# Altium schematic sheet Digital_Input.SchDoc: TTL Input Card
size Tabloid; Date: 05/10/2023; Engineer: Terry D. Schevker; Revision: 1.0; SheetNumber: 1; SheetTotal: 3
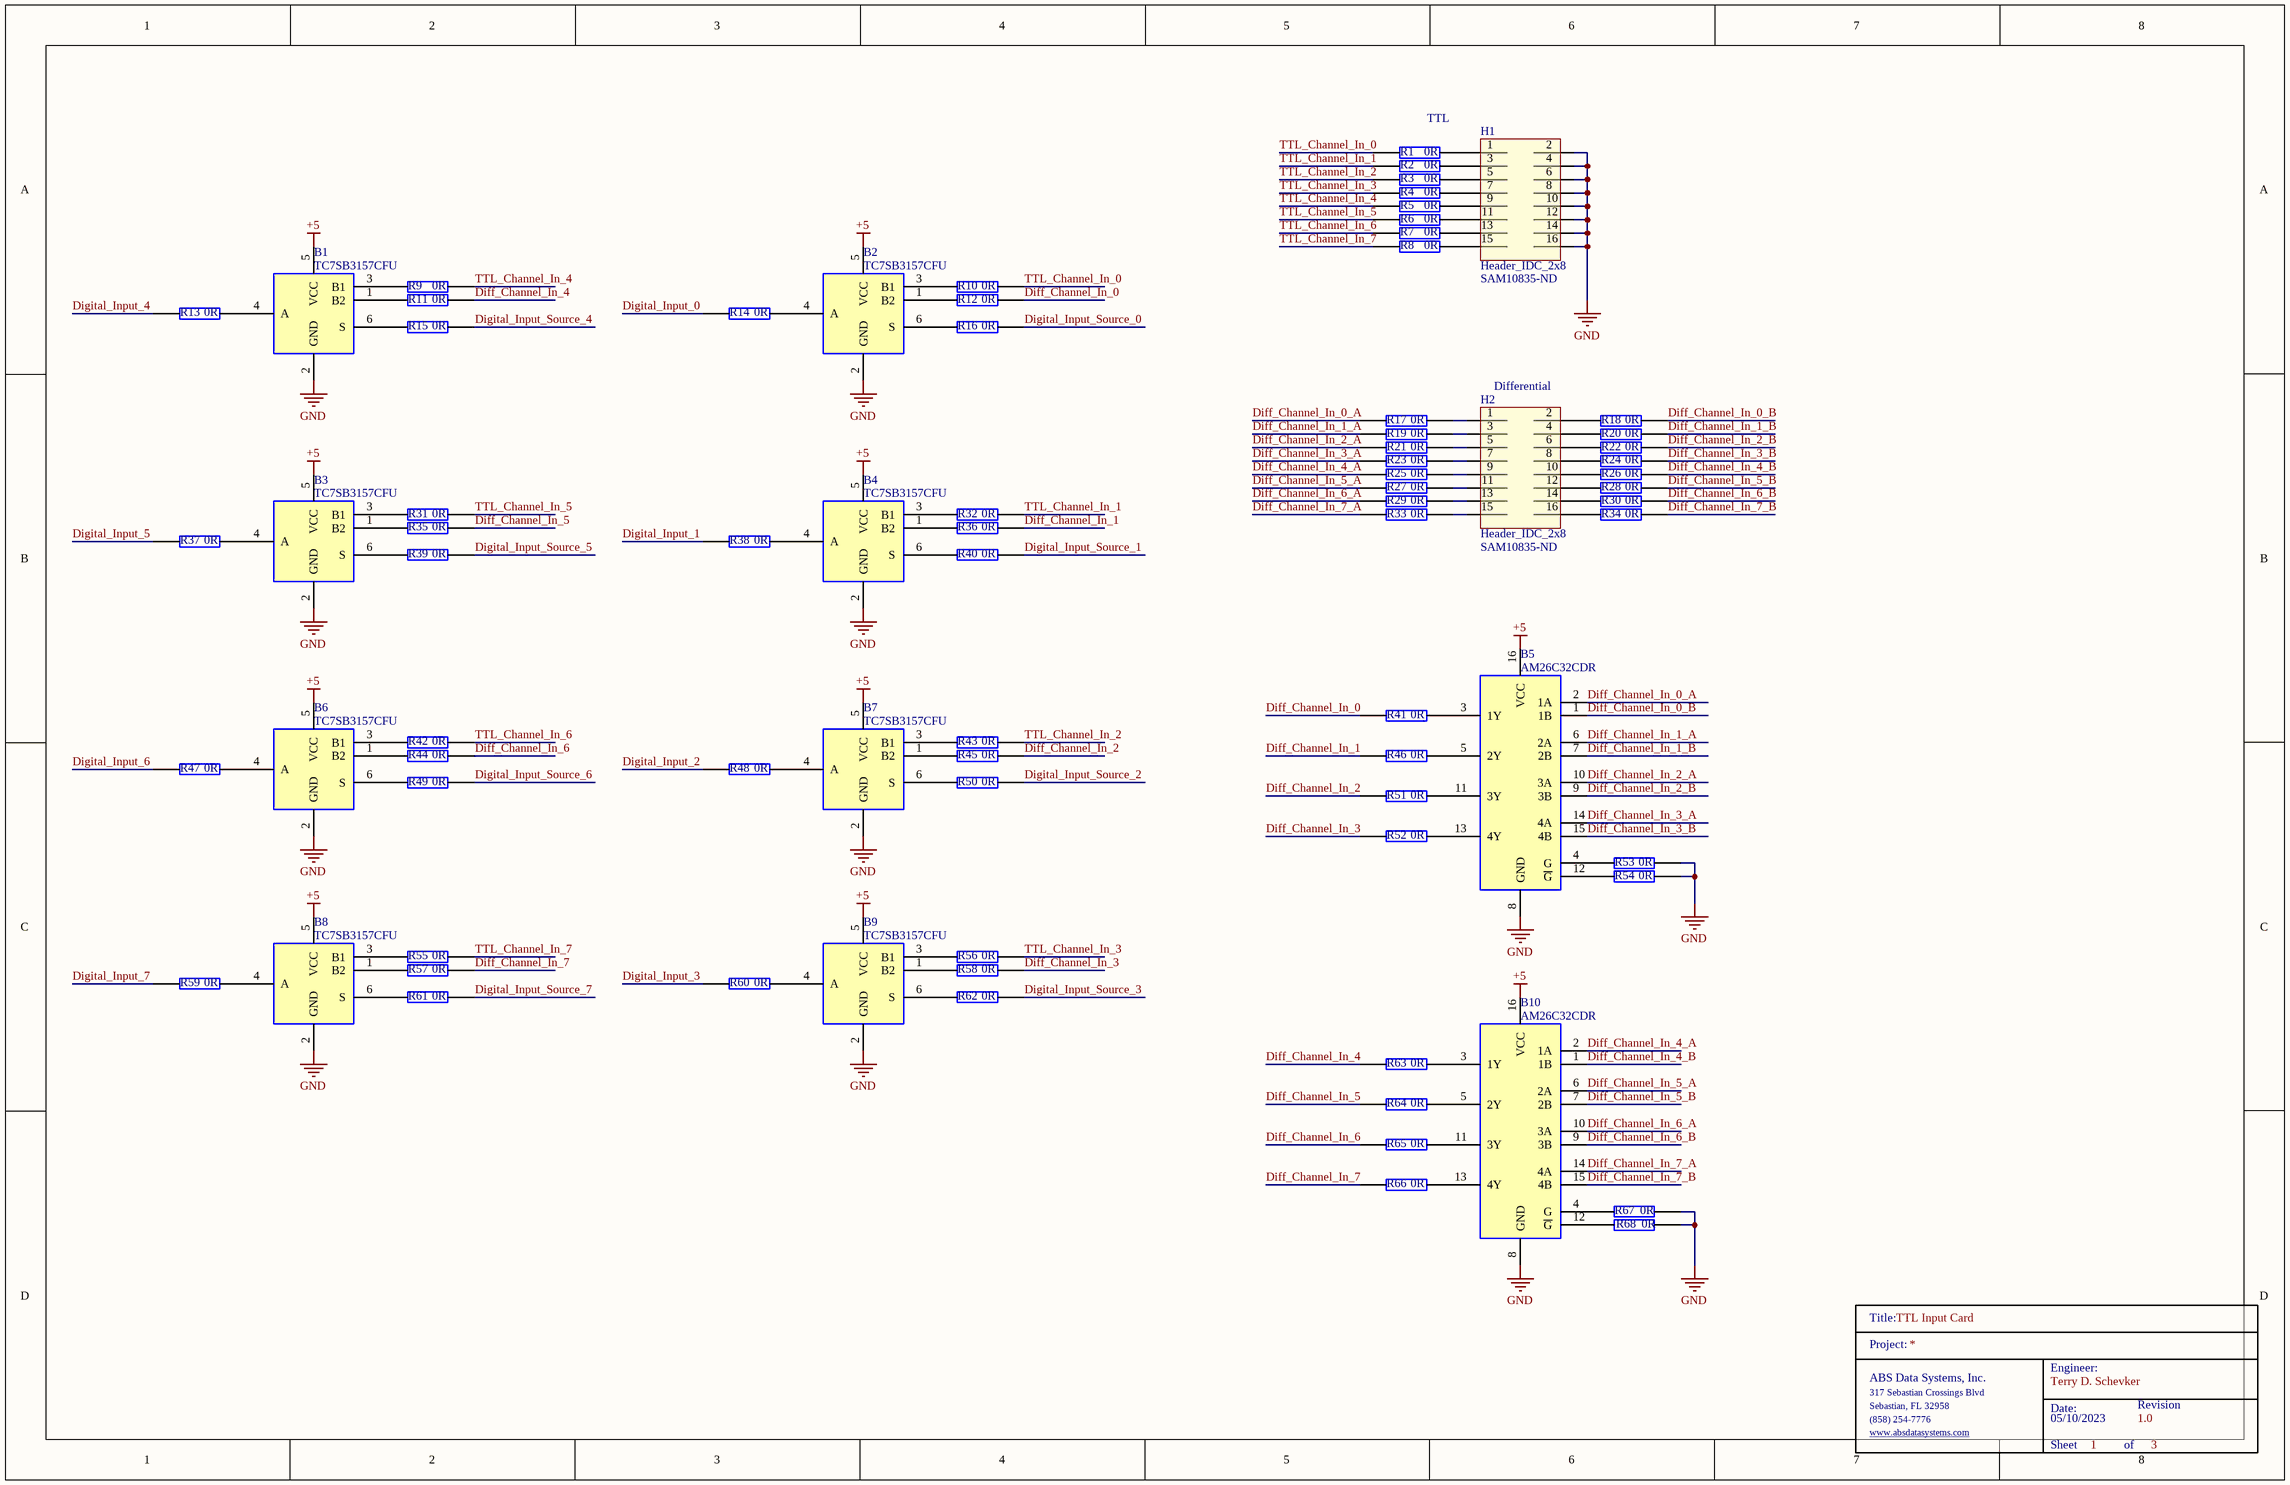
[diagram p0: Digital_Input.SchDoc]

## Parts
B1  TC7SB3157CFU  [SOT-363-6]
B2  TC7SB3157CFU  [SOT-363-6]
B3  TC7SB3157CFU  [SOT-363-6]
B4  TC7SB3157CFU  [SOT-363-6]
B5  AM26C32CDR  [SOIC127P600X175-16N]
B6  TC7SB3157CFU  [SOT-363-6]
B7  TC7SB3157CFU  [SOT-363-6]
B8  TC7SB3157CFU  [SOT-363-6]
B9  TC7SB3157CFU  [SOT-363-6]
B10  AM26C32CDR  [SOIC127P600X175-16N]
H1  Header_IDC_2x8  Supplier Part Number 1: SAM10835-ND  [HDR2X8]
H2  Header_IDC_2x8  Supplier Part Number 1: SAM10835-ND  [HDR2X8]
R1  0R  [0603]
R2  0R  [0603]
R3  0R  [0603]
R4  0R  [0603]
R5  0R  [0603]
R6  0R  [0603]
R7  0R  [0603]
R8  0R  [0603]
R9  0R  [0603]
R10  0R  [0603]
R11  0R  [0603]
R12  0R  [0603]
R13  0R  [0603]
R14  0R  [0603]
R15  0R  [0603]
R16  0R  [0603]
R17  0R  [0603]
R18  0R  [0603]
R19  0R  [0603]
R20  0R  [0603]
R21  0R  [0603]
R22  0R  [0603]
R23  0R  [0603]
R24  0R  [0603]
R25  0R  [0603]
R26  0R  [0603]
R27  0R  [0603]
R28  0R  [0603]
R29  0R  [0603]
R30  0R  [0603]
R31  0R  [0603]
R32  0R  [0603]
R33  0R  [0603]
R34  0R  [0603]
R35  0R  [0603]
R36  0R  [0603]
R37  0R  [0603]
R38  0R  [0603]
R39  0R  [0603]
R40  0R  [0603]
R41  0R  [0603]
R42  0R  [0603]
R43  0R  [0603]
R44  0R  [0603]
R45  0R  [0603]
R46  0R  [0603]
R47  0R  [0603]
R48  0R  [0603]
R49  0R  [0603]
R50  0R  [0603]
R51  0R  [0603]
R52  0R  [0603]
R53  0R  [0603]
R54  0R  [0603]
R55  0R  [0603]
R56  0R  [0603]
R57  0R  [0603]
R58  0R  [0603]
R59  0R  [0603]
R60  0R  [0603]
R61  0R  [0603]
R62  0R  [0603]
R63  0R  [0603]
R64  0R  [0603]
R65  0R  [0603]
R66  0R  [0603]
R67  0R  [0603]
R68  0R  [0603]
TitleBlock_4  TitleBlock  (value not drawn)  (graphical)

## Nets
+5: B1.5(VCC) B2.5(VCC) B3.5(VCC) B4.5(VCC) B5.16(VCC) B6.5(VCC) B7.5(VCC) B8.5(VCC) B9.5(VCC) B10.16(VCC)
GND: B1.2(GND) B2.2(GND) B3.2(GND) B4.2(GND) B5.8(GND) B6.2(GND) B7.2(GND) B8.2(GND) B9.2(GND) B10.8(GND) H1.2 H1.4 H1.6 H1.8 H1.10 H1.12 H1.14 H1.16 R53.2 R54.2 R67.2 R68.2
Diff_Channel_In_0: R12.2 R41.1
Diff_Channel_In_0_A: B5.2(1A) R17.1
Diff_Channel_In_0_B: B5.1(1B) R18.2
Diff_Channel_In_1: R36.2 R46.1
Diff_Channel_In_1_A: B5.6(2A) R19.1
Diff_Channel_In_1_B: B5.7(2B) R20.2
Diff_Channel_In_2: R45.2 R51.1
Diff_Channel_In_2_A: B5.10(3A) R21.1
Diff_Channel_In_2_B: B5.9(3B) R22.2
Diff_Channel_In_3: R52.1 R58.2
Diff_Channel_In_3_A: B5.14(4A) R23.1
Diff_Channel_In_3_B: B5.15(4B) R24.2
Diff_Channel_In_4: R11.2 R63.1
Diff_Channel_In_4_A: B10.2(1A) R25.1
Diff_Channel_In_4_B: B10.1(1B) R26.2
Diff_Channel_In_5: R35.2 R64.1
Diff_Channel_In_5_A: B10.6(2A) R27.1
Diff_Channel_In_5_B: B10.7(2B) R28.2
Diff_Channel_In_6: R44.2 R65.1
Diff_Channel_In_6_A: B10.10(3A) R29.1
Diff_Channel_In_6_B: B10.9(3B) R30.2
Diff_Channel_In_7: R57.2 R66.1
Diff_Channel_In_7_A: B10.14(4A) R33.1
Diff_Channel_In_7_B: B10.15(4B) R34.2
Digital_Input_0: R14.1
Digital_Input_1: R38.1
Digital_Input_2: R48.1
Digital_Input_3: R60.1
Digital_Input_4: R13.1
Digital_Input_5: R37.1
Digital_Input_6: R47.1
Digital_Input_7: R59.1
Digital_Input_Source_0: R16.2
Digital_Input_Source_1: R40.2
Digital_Input_Source_2: R50.2
Digital_Input_Source_3: R62.2
Digital_Input_Source_4: R15.2
Digital_Input_Source_5: R39.2
Digital_Input_Source_6: R49.2
Digital_Input_Source_7: R61.2
TTL_Channel_In_0: R1.1 R10.2
TTL_Channel_In_1: R2.1 R32.2
TTL_Channel_In_2: R3.1 R43.2
TTL_Channel_In_3: R4.1 R56.2
TTL_Channel_In_4: R5.1 R9.2
TTL_Channel_In_5: R6.1 R31.2
TTL_Channel_In_6: R7.1 R42.2
TTL_Channel_In_7: R8.1 R55.2
NetB1_1: B1.1(B2) R11.1
NetB1_3: B1.3(B1) R9.1
NetB1_4: B1.4(A) R13.2
NetB1_6: B1.6(S) R15.1
NetB2_1: B2.1(B2) R12.1
NetB2_3: B2.3(B1) R10.1
NetB2_4: B2.4(A) R14.2
NetB2_6: B2.6(S) R16.1
NetB3_1: B3.1(B2) R35.1
NetB3_3: B3.3(B1) R31.1
NetB3_4: B3.4(A) R37.2
NetB3_6: B3.6(S) R39.1
NetB4_1: B4.1(B2) R36.1
NetB4_3: B4.3(B1) R32.1
NetB4_4: B4.4(A) R38.2
NetB4_6: B4.6(S) R40.1
NetB5_3: B5.3(1Y) R41.2
NetB5_4: B5.4(G) R53.1
NetB5_5: B5.5(2Y) R46.2
NetB5_11: B5.11(3Y) R51.2
NetB5_12: B5.12(~{G}) R54.1
NetB5_13: B5.13(4Y) R52.2
NetB6_1: B6.1(B2) R44.1
NetB6_3: B6.3(B1) R42.1
NetB6_4: B6.4(A) R47.2
NetB6_6: B6.6(S) R49.1
NetB7_1: B7.1(B2) R45.1
NetB7_3: B7.3(B1) R43.1
NetB7_4: B7.4(A) R48.2
NetB7_6: B7.6(S) R50.1
NetB8_1: B8.1(B2) R57.1
NetB8_3: B8.3(B1) R55.1
NetB8_4: B8.4(A) R59.2
NetB8_6: B8.6(S) R61.1
NetB9_1: B9.1(B2) R58.1
NetB9_3: B9.3(B1) R56.1
NetB9_4: B9.4(A) R60.2
NetB9_6: B9.6(S) R62.1
NetB10_3: B10.3(1Y) R63.2
NetB10_4: B10.4(G) R67.1
NetB10_5: B10.5(2Y) R64.2
NetB10_11: B10.11(3Y) R65.2
NetB10_12: B10.12(~{G}) R68.1
NetB10_13: B10.13(4Y) R66.2
NetH1_1: H1.1 R1.2
NetH1_3: H1.3 R2.2
NetH1_5: H1.5 R3.2
NetH1_7: H1.7 R4.2
NetH1_9: H1.9 R5.2
NetH1_11: H1.11 R6.2
NetH1_13: H1.13 R7.2
NetH1_15: H1.15 R8.2
NetH2_1: H2.1 R17.2
NetH2_2: H2.2 R18.1
NetH2_3: H2.3 R19.2
NetH2_4: H2.4 R20.1
NetH2_5: H2.5 R21.2
NetH2_6: H2.6 R22.1
NetH2_7: H2.7 R23.2
NetH2_8: H2.8 R24.1
NetH2_9: H2.9 R25.2
NetH2_10: H2.10 R26.1
NetH2_11: H2.11 R27.2
NetH2_12: H2.12 R28.1
NetH2_13: H2.13 R29.2
NetH2_14: H2.14 R30.1
NetH2_15: H2.15 R33.2
NetH2_16: H2.16 R34.1

## Notes on the sheet
- TTL
- Differential
- (in symbol TitleBlock) Title:; Project:; Engineer:; ABS Data Systems, Inc.; 317 Sebastian Crossings Blvd; Sebastian, FL 32958; Date:; Revision; (858) 254-7776; www.absdatasystems.com; Sheet; of

## Library data of the parts
B1-B4 B6-B9 = TC7SB3157CFU: TC7SB3157CFU MUX 2 in 1 out with control bit; Manufacturer_Name: Nexperia; Manufacturer_Part_Number: PMP3906AYSH; Geometry.Height: 1.1mm; Mouser Part Number: 771-PMP3906AYSH; Mouser Price/Stock: https://www.mouser.co.uk/ProductDetail/Nexperia/PMP3906AYSH?qs=vvQtp7zwQdPhl6IciBiaKA%3D%3D; Datasheet Link: https://assets.nexperia.com/documents/data-sheet/PMP3906AYS.pdf
B5 B10 = AM26C32CDR: TEXAS INSTRUMENTS - AM26C32CDR - Receiver RS422/423, 4 Drivers, 4.5V-5.5V supply, SOIC-16; Geometry.Height: 1.75mm; Mouser Part Number: 595-AM26C32CDR; Mouser Price/Stock: https://www.mouser.co.uk/ProductDetail/Texas-Instruments/AM26C32CDR?qs=LgZHeZZt5MVmFjCK4imaTA%3D%3D; Manufacturer_Name: Texas Instruments; Manufacturer_Part_Number: AM26C32CDR; Datasheet Link: https://www.ti.com/lit/ds/symlink/am26c32.pdf?ts=1601403310434&ref_url=https%253A%252F%252Fwww.ti.com%252Fproduct%252FAM26C32
H1 H2 = Header_IDC_2x8: 16 Pin 2x8 Through Hold IDC Connector; Manufacturer: Samtec; Manufacturer Part Number: TST-108-01-G-D; Number of Contacts: 16; Gender: Male; Connector Type: Male Pin; Pitch: 2.54mm; Row Spacing: 0.1inch; Supplier 1: Digi-Key; RoHS: Yes; Category: Headers and Wire Housings; Stock 1: 227; Pricing 1: 1=2.85000, 10=2.73600, 100=2.28000, 500=1.93800, 1000=1.65300, 5000=1.48200 (USD); Mount: Through Hole; Contact Plating: Gold; Contact Material: Bronze; Housing Material: Polyester; Housing Color: Black; Color: Black; Min Operating Temperature: -55°C; Max Operating Temperature: 125°C; Number of Rows: 2; Termination: Solder; Packaging: Rail/Tube; Orientation: Straight; Number of Positions: 16; Length: 27.94mm; Depth: 9.27mm; Contact Mating Length: 0.25inch; REACH SVHC: No SVHC; ComponentLink1URL: https://datasheet.ciiva.com/739/tst-mkt-739845.pdf?src-supplier=Digi-Key; ComponentLink1Description: https://datasheet.ciiva.com/739/tst-mkt-739845.pdf?src-supplier=Digi-Key; ComponentLink2URL: https://datasheet.ciiva.com/10018/htst-10018510.pdf?src-supplier=Avnet; ComponentLink2Description: https://datasheet.ciiva.com/10018/htst-10018510.pdf?src-supplier=Avnet
R1-R68 = RC0603JR-070RL: YAGEO 0603 0 ohm; Manufacturer_Name: KEMET; Geometry.Height: 0.55mm; Mouser Part Number: 603-RC0603JR-070RL; Mouser Price/Stock: https://www.mouser.co.uk/ProductDetail/YAGEO/RC0603JR-070RL?qs=2cAdsCoAWRGWyPcuXgGiXQ%3D%3D; Manufacturer_Part_Number: RC0603JR-070RL; Datasheet Link: https://datasheet.datasheetarchive.com/originals/distributors/Datasheets_SAMA/902f9e387b938f871d31120f5fc1d65e.pdf